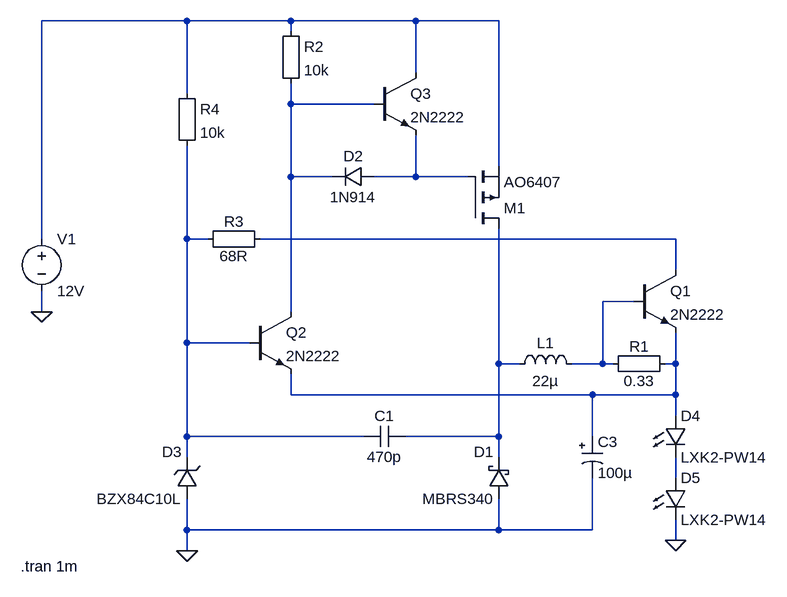
[diagram p0: schematic MOS_Black_Reg.asc]
MOS_Black_Reg.asc, the LTspice schematic file:
Version 4
SHEET 1 976 680
WIRE -128 -224 -352 -224
WIRE 32 -224 -128 -224
WIRE 224 -224 32 -224
WIRE 352 -224 224 -224
WIRE 32 -208 32 -224
WIRE 224 -144 224 -224
WIRE -128 -112 -128 -224
WIRE 32 -96 32 -128
WIRE 160 -96 32 -96
WIRE 352 0 352 -224
WIRE 32 16 32 -96
WIRE 96 16 32 16
WIRE 224 16 224 -48
WIRE 224 16 160 16
WIRE 304 16 224 16
WIRE -352 112 -352 -224
WIRE -128 112 -128 -32
WIRE -96 112 -128 112
WIRE 624 112 -16 112
WIRE 624 160 624 112
WIRE 560 208 512 208
WIRE -352 224 -352 192
WIRE 32 224 32 16
WIRE -128 272 -128 112
WIRE -32 272 -128 272
WIRE 352 304 352 96
WIRE 384 304 352 304
WIRE 512 304 512 208
WIRE 512 304 464 304
WIRE 528 304 512 304
WIRE 624 304 624 256
WIRE 624 304 608 304
WIRE 32 352 32 320
WIRE 496 352 32 352
WIRE 624 352 624 304
WIRE 624 352 496 352
WIRE 624 384 624 352
WIRE -128 416 -128 272
WIRE 144 416 -128 416
WIRE 352 416 352 304
WIRE 352 416 208 416
WIRE 496 416 496 352
WIRE -128 448 -128 416
WIRE 352 448 352 416
WIRE 624 480 624 448
WIRE -128 560 -128 512
WIRE 352 560 352 512
WIRE 352 560 -128 560
WIRE 496 560 496 480
WIRE 496 560 352 560
WIRE 624 576 624 544
WIRE -128 592 -128 560
FLAG -128 592 0
FLAG -352 224 0
FLAG 624 576 0
SYMBOL pmos 304 96 M180
SYMATTR InstName M1
SYMATTR Value AO6407
SYMBOL schottky 368 512 R180
WINDOW 0 24 72 Left 0
WINDOW 3 24 0 Left 0
SYMATTR InstName D1
SYMATTR Value MBRS340
SYMBOL ind 368 320 R270
WINDOW 0 32 56 VTop 0
WINDOW 3 5 56 VBottom 0
SYMATTR InstName L1
SYMATTR Value 22µ
SYMATTR SpiceLine Rser=25m
SYMBOL npn 560 160 R0
SYMATTR InstName Q1
SYMATTR Value 2N2222
SYMBOL npn -32 224 R0
SYMATTR InstName Q2
SYMATTR Value 2N2222
SYMBOL Misc\\EuropeanResistor 624 288 R90
WINDOW 0 5 56 VBottom 0
WINDOW 3 27 56 VTop 0
SYMATTR InstName R1
SYMATTR Value 0.33
SYMBOL npn 160 -144 R0
SYMATTR InstName Q3
SYMATTR Value 2N2222
SYMBOL diode 160 0 R90
WINDOW 0 0 32 VBottom 0
WINDOW 3 32 32 VTop 0
SYMATTR InstName D2
SYMATTR Value 1N914
SYMBOL Misc\\EuropeanResistor 16 -224 R0
SYMATTR InstName R2
SYMATTR Value 10k
SYMBOL Misc\\EuropeanResistor 0 96 R90
WINDOW 0 5 56 VBottom 0
WINDOW 3 27 56 VTop 0
SYMATTR InstName R3
SYMATTR Value 68R
SYMBOL cap 208 400 R90
WINDOW 0 0 32 VBottom 0
WINDOW 3 32 32 VTop 0
SYMATTR InstName C1
SYMATTR Value 470p
SYMBOL Misc\\EuropeanResistor -144 -128 R0
SYMATTR InstName R4
SYMATTR Value 10k
SYMBOL Misc\\EuropeanPolcap 480 416 R0
SYMATTR InstName C3
SYMATTR Value 100µ
SYMBOL zener -112 512 R180
WINDOW 0 24 72 Left 0
WINDOW 3 24 0 Left 0
SYMATTR InstName D3
SYMATTR Value BZX84C10L
SYMBOL voltage -352 96 R0
SYMATTR InstName V1
SYMATTR Value 12V
SYMBOL LED 608 384 R0
SYMATTR InstName D4
SYMATTR Value LXK2-PW14
SYMBOL LED 608 480 R0
SYMATTR InstName D5
SYMATTR Value LXK2-PW14
TEXT -384 616 Left 0 !.tran 1m

The netlist it stands for:
* MOS_Black_Reg.asc
M1 N007 N003 N001 N001 AO6407
D1 0 N007 MBRS340
L1 N007 N006 22µ Rser=25m
Q1 N005 N006 N008 0 2N2222
Q2 N002 N004 N008 0 2N2222
R1 N008 N006 0.33
Q3 N001 N002 N003 0 2N2222
D2 N003 N002 1N914
R2 N001 N002 10k
R3 N005 N004 68R
C1 N007 N004 470p
R4 N001 N004 10k
C3 N008 0 100µ
D3 0 N004 BZX84C10L
V1 N001 0 12V
D4 N008 N009 LXK2-PW14
D5 N009 0 LXK2-PW14
.model D D
.lib standard.dio
.model NPN NPN
.model PNP PNP
.lib standard.bjt
.model NMOS NMOS
.model PMOS PMOS
.lib standard.mos
.tran 1m
.backanno
.end